# Altium schematic sheet PCBINTER_SCHEMV2_Bottom.SchDoc
size A; SheetNumber: 1; SheetTotal: 1
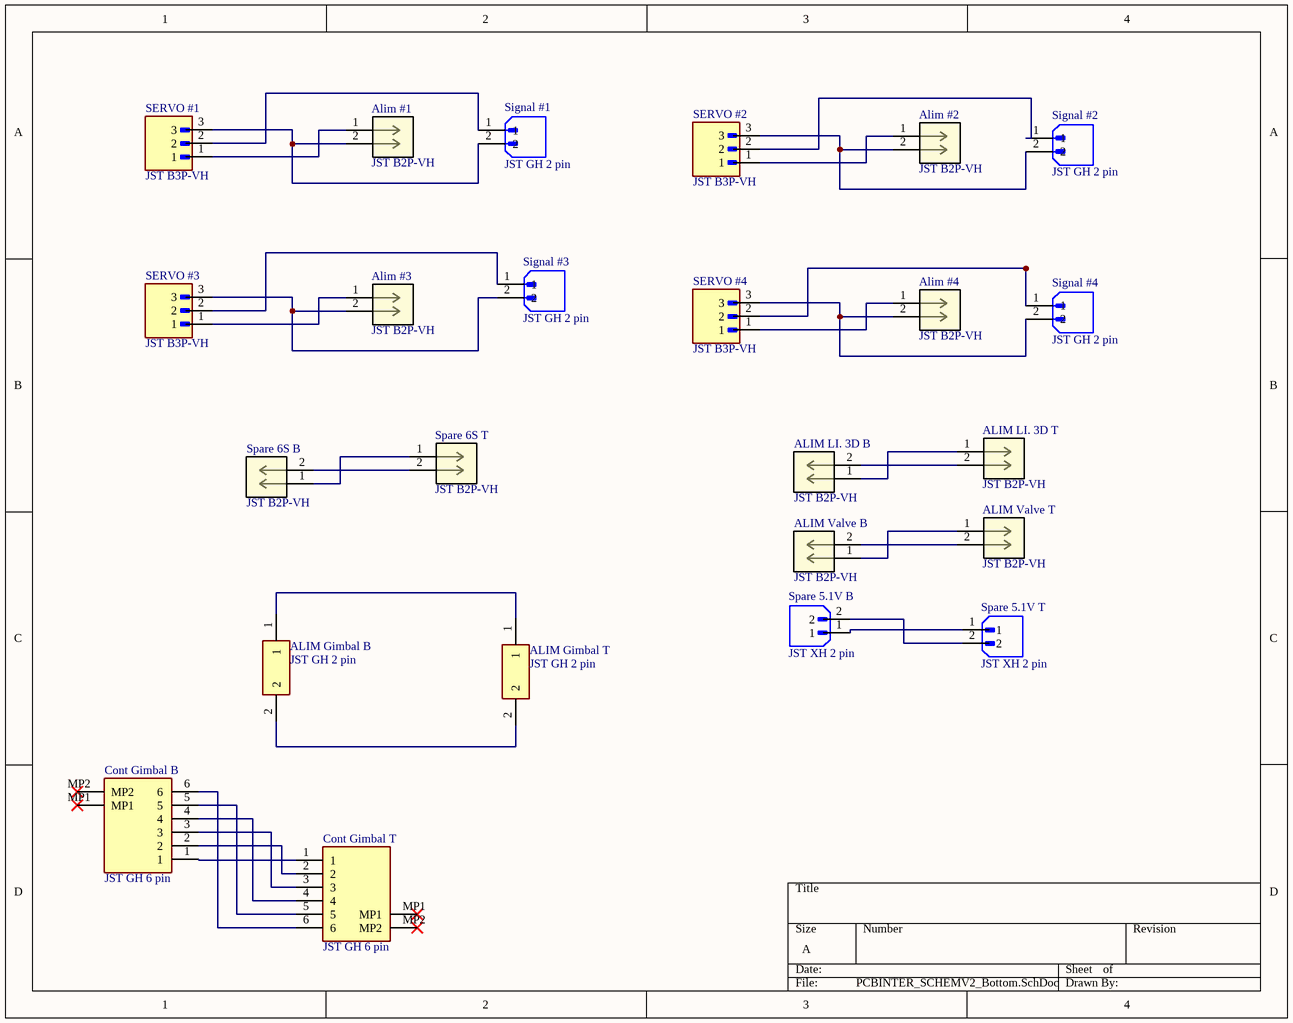
[diagram p0: PCBINTER_SCHEMV2_Bottom.SchDoc]

## Parts
Alim_#1  JST B2P-VH  [CONN_B2P-VH_JST]
Alim_#2  JST B2P-VH  [CONN_B2P-VH_JST]
Alim_#3  JST B2P-VH  [CONN_B2P-VH_JST]
Alim_#4  JST B2P-VH  [CONN_B2P-VH_JST]
ALIM_Gimbal_B  JST GH 2 pin  [BM02B-GHS-TBT_1]
ALIM_Gimbal_T  JST GH 2 pin  [BM02B-GHS-TBT_1]
ALIM_LI._3D_B  JST B2P-VH  [CONN_B2P-VH_JST]
ALIM_LI._3D_T  JST B2P-VH  [CONN_B2P-VH_JST]
ALIM_Valve_B  JST B2P-VH  [CONN_B2P-VH_JST]
ALIM_Valve_T  JST B2P-VH  [CONN_B2P-VH_JST]
Cont_Gimbal_B  JST GH 6 pin  [BM06BGHSTBTLFSN]
Cont_Gimbal_T  JST GH 6 pin  [BM06BGHSTBTLFSN]
SERVO_#1  JST B3P-VH  [JST_B3P-VH(LF)(SN)]
SERVO_#2  JST B3P-VH  [JST_B3P-VH(LF)(SN)]
SERVO_#3  JST B3P-VH  [JST_B3P-VH(LF)(SN)]
SERVO_#4  JST B3P-VH  [JST_B3P-VH(LF)(SN)]
Signal_#1  JST GH 2 pin  [JST_BM02B-GHS-TBT(LF)(SN)]
Signal_#2  JST GH 2 pin  [JST_BM02B-GHS-TBT(LF)(SN)]
Signal_#3  JST GH 2 pin  [JST_BM02B-GHS-TBT(LF)(SN)]
Signal_#4  JST GH 2 pin  [JST_BM02B-GHS-TBT(LF)(SN)]
Spare_5.1V_B  JST XH 2 pin  [JST_B2B-XH-A_(LF)(SN)]
Spare_5.1V_T  JST XH 2 pin  [JST_B2B-XH-A_(LF)(SN)]
Spare_6S_B  JST B2P-VH  [CONN_B2P-VH_JST]
Spare_6S_T  JST B2P-VH  [CONN_B2P-VH_JST]

## Nets
NetAlim_#1_1: Alim_#1.1 SERVO_#1.1
NetAlim_#1_2: Alim_#1.2 SERVO_#1.3 Signal_#1.2
NetAlim_#2_1: Alim_#2.1 SERVO_#2.1
NetAlim_#2_2: Alim_#2.2 SERVO_#2.3 Signal_#2.2
NetAlim_#3_1: Alim_#3.1 SERVO_#3.1
NetAlim_#3_2: Alim_#3.2 SERVO_#3.3 Signal_#3.2
NetAlim_#4_1: Alim_#4.1 SERVO_#4.1
NetAlim_#4_2: Alim_#4.2 SERVO_#4.3 Signal_#4.2
NetALIM_Gimbal_B_1: ALIM_Gimbal_B.1 ALIM_Gimbal_T.1
NetALIM_Gimbal_B_2: ALIM_Gimbal_B.2 ALIM_Gimbal_T.2
NetALIM_LI._3D_B_1: ALIM_LI._3D_B.1 ALIM_LI._3D_T.1
NetALIM_LI._3D_B_2: ALIM_LI._3D_B.2 ALIM_LI._3D_T.2
NetALIM_Valve_B_1: ALIM_Valve_B.1 ALIM_Valve_T.1
NetALIM_Valve_B_2: ALIM_Valve_B.2 ALIM_Valve_T.2
NetCont_Gimbal_B_1: Cont_Gimbal_B.1 Cont_Gimbal_T.1
NetCont_Gimbal_B_2: Cont_Gimbal_B.2 Cont_Gimbal_T.2
NetCont_Gimbal_B_3: Cont_Gimbal_B.3 Cont_Gimbal_T.3
NetCont_Gimbal_B_4: Cont_Gimbal_B.4 Cont_Gimbal_T.4
NetCont_Gimbal_B_5: Cont_Gimbal_B.5 Cont_Gimbal_T.5
NetCont_Gimbal_B_6: Cont_Gimbal_B.6 Cont_Gimbal_T.6
NetSERVO_#1_2: SERVO_#1.2 Signal_#1.1
NetSERVO_#2_2: SERVO_#2.2 Signal_#2.1
NetSERVO_#3_2: SERVO_#3.2 Signal_#3.1
NetSERVO_#4_2: SERVO_#4.2 Signal_#4.1
NetSpare_5.1V_B_1: Spare_5.1V_B.1 Spare_5.1V_T.1
NetSpare_5.1V_B_2: Spare_5.1V_B.2 Spare_5.1V_T.2
NetSpare_6S_B_1: Spare_6S_B.1 Spare_6S_T.1
NetSpare_6S_B_2: Spare_6S_B.2 Spare_6S_T.2

Not connected (* = marked no-connect by the designer): Cont_Gimbal_B MP1* MP2*; Cont_Gimbal_T MP1* MP2*

## Library data of the parts
Alim_#1-Alim_#4 ALIM_LI._3D_B ALIM_LI._3D_T ALIM_Valve_B ALIM_Valve_T Spare_6S_B Spare_6S_T = B2P-VHLFSN: JST VH 2 pin; Manufacturer_Part_Number: B2P-VH(LF)(SN); Copyright: Copyright (C) 2025 Ultra Librarian. All rights reserved.; Manufacturer_Name: JST; RefDes: RefDes; Type: Type
ALIM_Gimbal_B ALIM_Gimbal_T = BM02B-GHS-TBT_LF__SN__N_: Connector; Manufacturer_Name: JST (JAPAN SOLDERLESS TERMINALS); Manufacturer_Part_Number: BM02B-GHS-TBT(LF)(SN)(N); Datasheet Link: http://www.jst-mfg.com/product/pdf/eng/eGH.pdf; Arrow Part Number: BM02B-GHS-TBT(LF)(SN)(N); Arrow Price/Stock: https://www.arrow.com/en/products/bm02b-ghs-tbt-lf-sn-n/jst-manufacturing?region=nac
Cont_Gimbal_B Cont_Gimbal_T = BM06B-GHS-TBT_LF__SN_: Connector; Manufacturer_Name: JST (JAPAN SOLDERLESS TERMINALS); Manufacturer_Part_Number: BM06B-GHS-TBT(LF)(SN); Datasheet Link: https://datasheet.lcsc.com/szlcsc/2004111131_JST-Sales-America-BM06B-GHS-TBT-LF-SN_C495534.pdf; Height: 4.05mm; Mouser Part Number: 306-BM06BGHSTBTLFSNN; Mouser Price/Stock: https://www.mouser.co.uk/ProductDetail/JST-Commercial/BM06B-GHS-TBTLFSN?qs=cdbOS8ANM9CObKjnhD04mw%3D%3D
SERVO_#1-SERVO_#4 = B3P-VH(LF)(SN): JST VH 3 PIN; MF: JST Sales; SnapEDA_Link: https://www.snapeda.com/parts/B3P-VH(LF)(SN)/JST/view-part/?ref=snap; Package: None; Value: *; MP: B3P-VH(LF)(SN); Check_prices: https://www.snapeda.com/parts/B3P-VH(LF)(SN)/JST/view-part/?ref=eda
Signal_#1-Signal_#4 = BM02B-GHS-TBT(LF)(SN): Connector Header Surface Mount 2 position 0.049 (1.25mm); MF: JST Sales; SnapEDA_Link: https://www.snapeda.com/parts/BM02B-GHS-TBT%20(LF)(SN)/JST/view-part/?ref=snap; Package: None; Value: *; MP: BM02B-GHS-TBT (LF)(SN); Check_prices: https://www.snapeda.com/parts/BM02B-GHS-TBT%20(LF)(SN)/JST/view-part/?ref=eda
Spare_5.1V_B Spare_5.1V_T = B2B-XH-A_(LF)(SN): Connector Header Through Hole 2 position 0.098 (2.50mm); MF: JST Sales; MP: B2B-XH-A (LF)(SN); SnapEDA_Link: https://www.snapeda.com/parts/B2B-XH-A%20(LF)(SN)/JST+Sales+America+Inc./view-part/?ref=snap; Package: None; Value: *; Check_prices: https://www.snapeda.com/parts/B2B-XH-A%20(LF)(SN)/JST+Sales+America+Inc./view-part/?ref=eda